# EAGLE board AZSMZ (EAGLE 6.1)
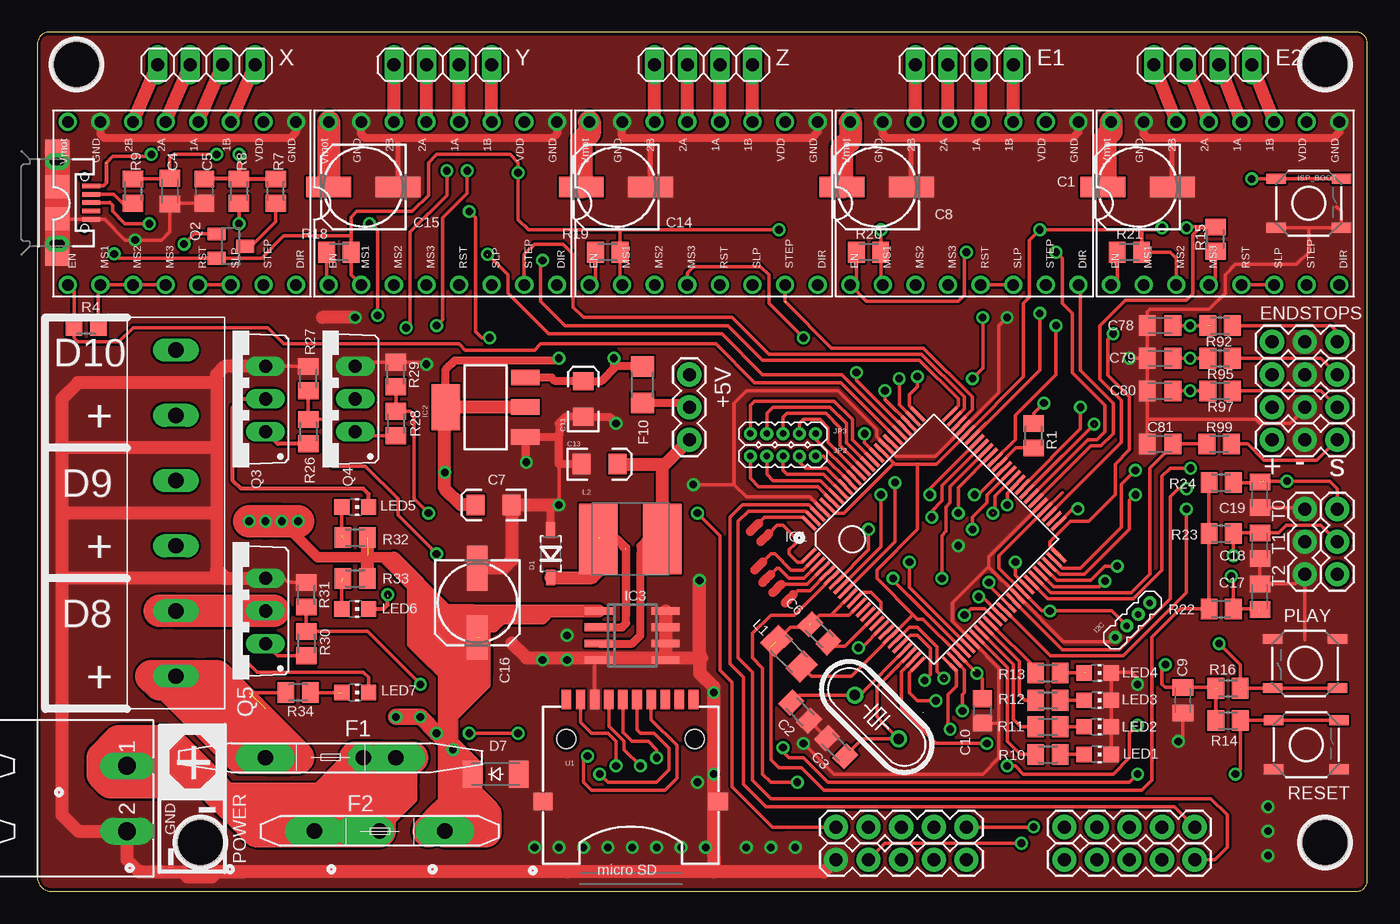
[diagram p2: board, top side]
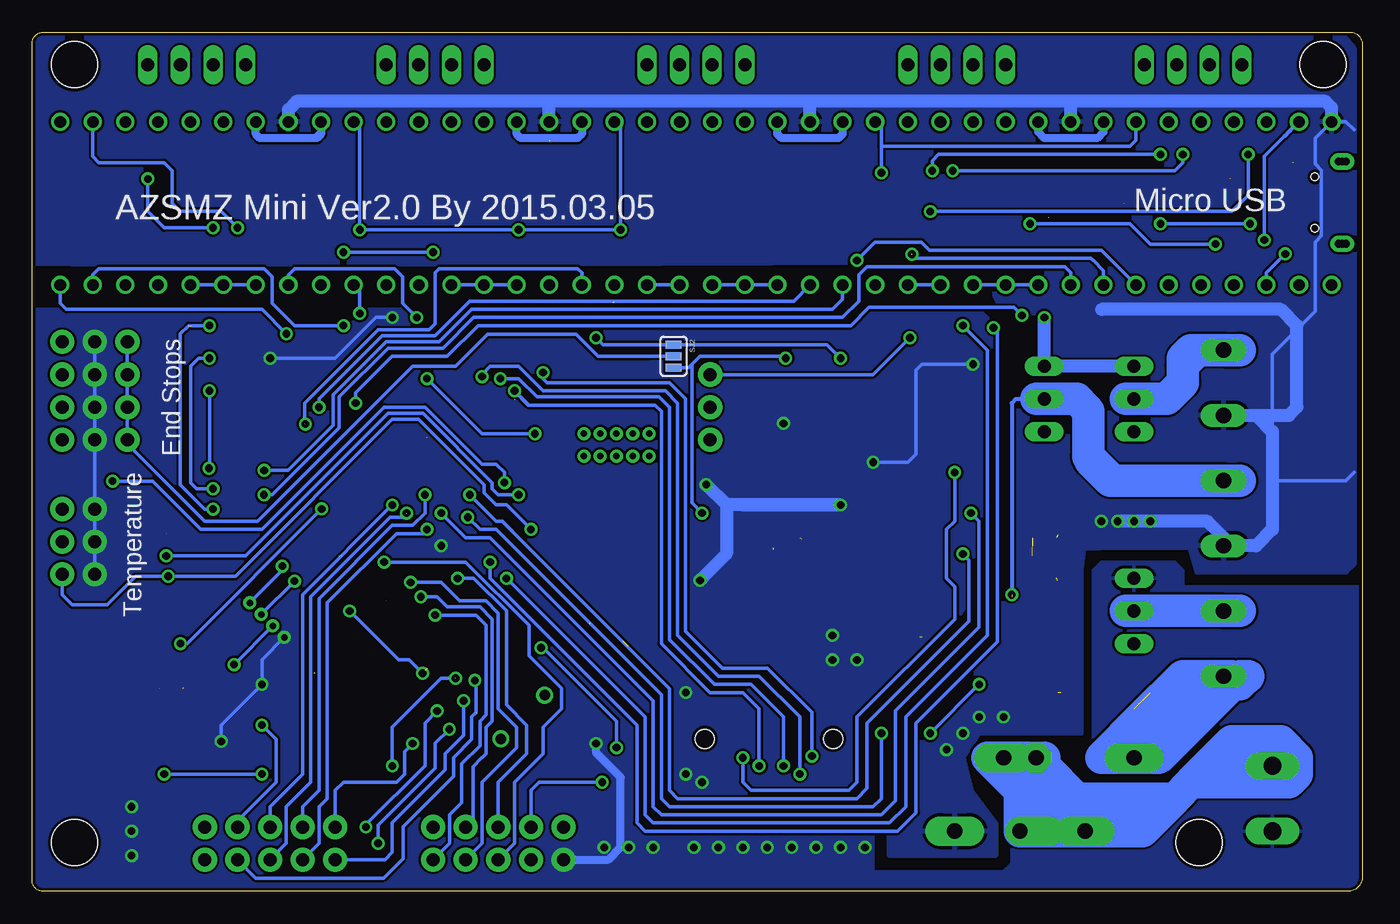
[diagram p3: board, bottom side, seen from below]

Size 103.64 x 66.93 mm. Coordinates in mm from the lower left corner, seen from the top.
Outline: 102.75,66.93 1.01,66.93 arc90 0.01,66.04 0.01,1.27 arc90 1.01,0 102.78,0 arc90 103.64,0.89 103.64,66.04 arc90 102.75,66.93
Copper layers (1*2+15*16): Top 0.035mm / dielectric 0.5mm / layer 2 0.035mm / dielectric 0.5mm / layer 15 0.035mm / dielectric 0.5mm / Bottom 0.035mm
Design rules: minimum track width 10mil, minimum drill 12mil, track to track 7mil, track to pad 7mil, pad to pad 7mil, via to via 7mil, smd to smd 7mil, copper to edge 10mil, drill to drill 8mil, minimum pad ring 10mil, minimum via ring 8mil, stop-mask expansion 0mil, vias tented up to drill 0.61mm, thermal gap 10mil
Holes 3.6 mm at 100.34,64.39 3.06,64.39 12.71,3.81 100.34,3.81

## Footprints (pad centres in the part's own frame; a part is rotated, then mirrored left to right if it is on the bottom)
HC49/S = drill 0.813: 1 -2.413,0; 2 2.413,0
1X03 = drill 1.016 pad 1.88: 1 0,0; 2 2.54,0; 3 5.08,0
153CLV-0605 = smd 3.5 x 1.6: + 2.7,0; - -2.7,0
C0805K = smd 1.3 x 1.6: 1 -1,0; 2 1,0
C0805 = smd 1.3 x 1.5: 1 -0.95,0; 2 0.95,0
EIA3216 = smd 1.4 x 1.6: A 1.4,0; C -1.4,0
SOD-123 = smd 1.2 x 0.7: A 1.85,0; C -1.85,0
SOD-123_MINI-SMA = smd 1.5 x 2.1: A 1.8,0; C -1.8,0
1X04 = drill 1.016 long: 1 -3.81,0; 2 -1.27,0; 3 1.27,0; 4 3.81,0
REPRAPJR_MFR1100 = drill 1.2 pad 2.3 long: 1 -5.08,0; 2 5.08,0 | drill 1.2 pad 2.3 octagon: 3 -2.54,0
REPRAPJR_MFR500 = drill 1.2 pad 2.3 long: 1 -5.08,0; 2 5.08,0 | drill 1.2 pad 2.3 offset: 3 0,0
R1206 = smd 1.6 x 1.803: 1 -1.422,0; 2 1.422,0
1X04-1.27MM = drill 0.508 pad 1: 1 0,0; 2 1.27,0; 3 2.54,0; 4 3.81,0
LQFP100 = smd 0.27 x 1.5: 1 -6,-7.75; 2 -5.5,-7.75; 3 -5,-7.75; 4 -4.5,-7.75; 5 -4,-7.75; 6 -3.5,-7.75; 7 -3,-7.75; 8 -2.5,-7.75; 9 -2,-7.75; 10 -1.5,-7.75; 11 -1,-7.75; 12 -0.5,-7.75; 13 0,-7.75; 14 0.5,-7.75; 15 1,-7.75; 16 1.5,-7.75; 17 2,-7.75; 18 2.5,-7.75; 19 3,-7.75; 20 3.5,-7.75; 21 4,-7.75; 22 4.5,-7.75; 23 5,-7.75; 24 5.5,-7.75; 25 6,-7.75; 51 6,7.75; 52 5.5,7.75; 53 5,7.75; 54 4.5,7.75; 55 4,7.75; 56 3.5,7.75; 57 3,7.75; 58 2.5,7.75; 59 2,7.75; 60 1.5,7.75; 61 1,7.75; 62 0.5,7.75; 63 0,7.75; 64 -0.5,7.75; 65 -1,7.75; 66 -1.5,7.75; 67 -2,7.75; 68 -2.5,7.75; 69 -3,7.75; 70 -3.5,7.75; 71 -4,7.75; 72 -4.5,7.75; 73 -5,7.75; 74 -5.5,7.75; 75 -6,7.75 | smd 1.5 x 0.27: 26 7.75,-6; 27 7.75,-5.5; 28 7.75,-5; 29 7.75,-4.5; 30 7.75,-4; 31 7.75,-3.5; 32 7.75,-3; 33 7.75,-2.5; 34 7.75,-2; 35 7.75,-1.5; 36 7.75,-1; 37 7.75,-0.5; 38 7.75,0; 39 7.75,0.5; 40 7.75,1; 41 7.75,1.5; 42 7.75,2; 43 7.75,2.5; 44 7.75,3; 45 7.75,3.5; 46 7.75,4; 47 7.75,4.5; 48 7.75,5; 49 7.75,5.5; 50 7.75,6; 76 -7.75,6; 77 -7.75,5.5; 78 -7.75,5; 79 -7.75,4.5; 80 -7.75,4; 81 -7.75,3.5; 82 -7.75,3; 83 -7.75,2.5; 84 -7.75,2; 85 -7.75,1.5; 86 -7.75,1; 87 -7.75,0.5; 88 -7.75,0; 89 -7.75,-0.5; 90 -7.75,-1; 91 -7.75,-1.5; 92 -7.75,-2; 93 -7.75,-2.5; 94 -7.75,-3; 95 -7.75,-3.5; 96 -7.75,-4; 97 -7.75,-4.5; 98 -7.75,-5; 99 -7.75,-5.5; 100 -7.75,-6
SOT223 = smd 1.219 x 2.235: 1 -2.311,-3.099; 2 0,-3.099; 3 2.311,-3.099 | smd 3.6 x 2.2: 4 0,3.099
SO08 = smd 0.6 x 2.2: 1 -1.905,-2.6; 2 -0.635,-2.6; 3 0.635,-2.6; 4 1.905,-2.6; 5 1.905,2.6; 6 0.635,2.6; 7 -0.635,2.6; 8 -1.905,2.6
TACTILE_SWITCH_SMD = smd 1.524 x 0.762: 1 -2.54,1.905; 2 2.54,1.905; 3 -2.54,-1.905; 4 2.54,-1.905
1X05-1.27MM = drill 0.508 pad 1: 1 0,0; 2 1.27,0; 3 2.54,0; 4 3.81,0; 5 5.08,0
1X05 = drill 1.016 pad 1.88: 1 0,0; 2 2.54,0; 3 5.08,0; 4 7.62,0; 5 10.16,0
M1206 = smd 1.6 x 2: 1 -1.4,0; 2 1.4,0
CR54 = smd 5.5 x 3: P$1 0,2.5; P$2 0,-2.5
CHIP-LED0805 = smd 1.2 x 1.2: A 0,-1.05; C 0,1.05
MSTBA2 = drill 1.397 long: 1 -2.54,5.08; 2 2.54,5.08
SOT23 = smd 1 x 1.4: 1 -0.95,-1.1; 2 0.95,-1.1; 3 0,1.1
TO220BV = drill 1.016 long: D 0,-2.54; G -2.54,-2.54; S 2.54,-2.54
M0805 = smd 1.3 x 1.6: 1 -0.95,0; 2 0.95,0
SJ_3 = smd 0.635 x 1.27: 1 -0.889,0; 2 0,0; 3 0.889,0
USD-SOCKET-PP = smd 0.75 x 1.5: 1 2.7,12.8; 2 1.6,12.8; 3 0.5,12.8; 4 -0.6,12.8; 5 -1.7,12.8; 6 -2.8,12.8; 8 -5,12.8; CD1 3.8,12.8; CD2 4.9,12.8 | smd 0.7 x 1.5: 7 -3.9,12.8 | smd 1.5 x 1.35: GND1 -6.83,4.84; GND2 6.83,4.84 | hole 1.5: -5,9.73; 5,9.73
282837-6 = drill 1.2 long: P$1 0,-12.7; P$2 0,-7.62; P$3 0,-2.54; P$4 0,2.54; P$5 0,7.62; P$6 0,12.7
A4988BREAKOUT = drill 0.9: 1A 8.89,1.27; 1B 11.43,1.27; 2A 6.35,1.27; 2B 3.81,1.27; DIR 16.51,-11.43; EN -1.27,-11.43; GND 16.51,1.27; GND@0 1.27,1.27; MS1 1.27,-11.43; MS2 3.81,-11.43; MS3 6.35,-11.43; RST 8.89,-11.43; SLP 11.43,-11.43; STEP 13.97,-11.43; VDD 13.97,1.27; VMOT -1.27,1.27
USB-MICROB = smd 0.35 x 1.4: D+ 0,2.65; D- -0.65,2.65; GND 1.3,2.65; ID 0.65,2.65; VBUS -1.3,2.65 | smd 1.8 x 1.9: MT1 -4,0; MT2 4,0; MT3 -1.25,0; MT4 1.25,0 | drill 0.6 pad 1.27: P$1 -3.2,-0.3; P$2 3.2,0; P$3 -3.2,0; P$4 -3.2,0.3; P$5 3.2,0.3; P$6 3.2,-0.3 | hole 0.6: 2,2.15; -2,2.15

## Placement (x,y rotation side)
12M  [HC49/S]  65.41,13.59 135 top
+5V  [1X03]  50.81,35.18 90 top
C1  [153CLV-0605]  85.73,54.86 180 top
C2  12pF  [C0805K]  59.44,14 315 top
C3  12pF  [C0805K]  62.24,11.24 135 top
C4  18pF  [C0805K]  10.33,54.55 90 top
C5  18pF  [C0805]  13.03,54.55 90 top
C6  100nF  [C0805K]  60.95,20.11 315 top
C7  10uF  [EIA3216]  35.57,30.1 180 top
C8  [153CLV-0605]  65.41,54.86 180 top
C9  100nF  [C0805K]  89.26,14.89 90 top
C10  100nF  [C0805]  73.64,14.07 90 top
C11  10uF  [EIA3216]  42.55,38.35 90 top
C13  10uF  [EIA3216]  43.82,33.27 0 top
C14  [153CLV-0605]  45.09,54.86 180 top
C15  [153CLV-0605]  25.41,54.86 180 top
C16  [153CLV-0605]  34.3,22.48 270 top
C17  .1uF  [C0805K]  95.26,22.96 270 top
C18  .1uF  [C0805K]  95.26,26.92 90 top
C19  .1uF  [C0805K]  95.26,30.89 90 top
C78  100nF  [C0805K]  87.48,44.07 180 top
C79  100nF  [C0805K]  87.48,41.53 180 top
C80  100nF  [C0805K]  87.48,38.99 180 top
C81  100nF  [C0805K]  87.48,34.86 180 top
D1  SS14  [SOD-123]  40.01,26.29 90 top
D7  IN4004  [SOD-123_MINI-SMA]  35.73,9.14 0 top
E1  [1X04]  72.24,64.39 0 top
E2  [1X04]  90.81,64.39 0 top
F1  [REPRAPJR_MFR1100]  22.87,10.41 180 top
F2  [REPRAPJR_MFR500]  26.68,4.7 0 top
F10  500MA  [R1206]  47.16,39.47 270 top
I2C  [1X04-1.27MM]  86.69,22.48 225 top
IC1  LPC1769  [LQFP100]  69.86,27.43 315 top
IC2  [SOT223]  34.93,37.72 90 top
IC3  LM2594  [SO08]  46.36,19.94 270 top
ISP_BOOT  [TACTILE_SWITCH_SMD]  99.07,53.59 0 top
JP2  [1X05-1.27MM]  60.65,33.91 180 top
JP3  [1X05-1.27MM]  55.57,35.66 0 top
JP8  [1X03]  101.29,42.8 180 top
JP9  [1X03]  101.29,40.26 180 top
JP10  [1X03]  101.29,37.72 180 top
JP11  [1X03]  101.29,35.18 180 top
JP12  [1X03]  101.29,24.7 90 top
JP14  [1X03]  98.75,24.7 90 top
JP15  [1X05]  72.4,5.02 180 top
JP16  [1X05]  90.18,2.48 180 top
JP17  [1X05]  90.18,5.02 180 top
JP32  [1X05]  72.4,2.48 180 top
L1  22uh  [M1206]  58.59,18.51 315 top
L2  68uH  [CR54]  46.21,27.46 90 top
LED1  [CHIP-LED0805]  82.62,10.67 270 top
LED2  [CHIP-LED0805]  82.62,12.83 270 top
LED3  [CHIP-LED0805]  82.62,14.89 270 top
LED4  [CHIP-LED0805]  82.62,17.02 270 top
LED5  [CHIP-LED0805]  24.77,29.94 270 top
LED6  [CHIP-LED0805]  24.77,22 270 top
LED7  [CHIP-LED0805]  24.77,15.49 270 top
PLAY  [TACTILE_SWITCH_SMD]  98.78,17.75 180 top
POWER  MSTBA2  [MSTBA2]  1.91,7.24 270 top
Q2  BSS84  [SOT23]  15.09,50.26 270 top
Q3  IRF512  [TO220BV]  15.25,38.35 90 top
Q4  IRF512  [TO220BV]  22.23,38.35 90 top
Q5  IRF512  [TO220BV]  15.25,21.84 90 top
R1  1.5K  [M0805]  77.64,35.5 270 top
R4  10K  [M0805]  3.82,44.07 0 top
R7  1.5K  [M0805]  18.58,54.55 270 top
R8  33R  [M0805]  15.72,54.55 90 top
R9  33R  [M0805]  7.47,54.55 90 top
R10  1k  [M0805]  78.75,10.67 180 top
R11  1k  [M0805]  78.75,12.83 180 top
R12  1k  [M0805]  78.75,14.89 180 top
R13  1k  [M0805]  78.75,17.02 180 top
R14  10K  [M0805]  92.78,13.3 180 top
R15  10K  [M0805]  91.8,50.81 270 top
R16  10K  [M0805]  92.77,15.82 180 top
R18  10K  [M0805]  23.5,49.78 0 top
R19  10K  [M0805]  44.46,49.78 0 top
R20  10K  [M0805]  64.78,49.78 0 top
R21  10K  [M0805]  85.1,49.78 0 top
R22  4k7  [M0805]  92.24,22 180 top
R23  4k7  [M0805]  92.24,27.88 180 top
R24  4k7  [M0805]  92.24,31.85 180 top
R26  10R  [M0805]  21.12,35.81 90 top
R27  100K  [M0805]  21.12,39.94 270 top
R28  10R  [M0805]  27.95,36.45 90 top
R29  100K  [M0805]  27.95,40.26 270 top
R30  10R  [M0805]  20.96,19.3 90 top
R31  100K  [M0805]  20.96,23.11 270 top
R32  1.8K  [M0805]  24.77,27.56 180 top
R33  1.8K  [M0805]  24.77,24.38 180 top
R34  1.8K  [M0805]  20.33,15.49 0 top
R92  1k  [M0805]  92.16,44.07 180 top
R95  1k  [M0805]  92.16,41.53 180 top
R97  1k  [M0805]  92.16,38.99 180 top
R99  1k  [M0805]  92.08,34.86 180 top
RESET  [TACTILE_SWITCH_SMD]  98.88,11.43 0 top
SJ2  [SJ_3]  53.67,41.69 270 bottom
U1  USD-SOCKETUSD  [USD-SOCKET-PP]  46.24,2.16 0 top
U$3  282837-6  [282837-6]  10.8,29.46 180 top
U$11  A4988BREAKOUT  [A4988BREAKOUT]  3.66,58.67 0 top
U$12  A4988BREAKOUT  [A4988BREAKOUT]  23.98,58.67 0 top
U$13  A4988BREAKOUT  [A4988BREAKOUT]  44.3,58.67 0 top
U$14  A4988BREAKOUT  [A4988BREAKOUT]  64.62,58.67 0 top
U$15  A4988BREAKOUT  [A4988BREAKOUT]  84.94,58.67 0 top
X  [1X04]  13.18,64.39 0 top
X1  USB-MICROB  [USB-MICROB]  1.56,53.64 270 top
Y  [1X04]  31.6,64.39 0 top
Z  [1X04]  51.92,64.39 0 top

## Tracks (layer width: path | path; a pad name or v marks a point on that pad's centre or on a via)
3.3V  (via drill 0.6)  (5 unrouted)
  Top 0.254: IC1.42 77.96,22.16 | IC1.96 62.17,29.46 62.87,29.46 66.68,33.27 66.68,33.44 | IC1.71 70.68,33.91 | IC1.84 66.68,33.44 | 66.68,33.44 66.84,33.27 68.59,33.27 | 68.59,33.27 70.04,33.27 IC1.71 | IC1.71 76.84,40.07 76.84,45.82 77.32,46.29 77.32,50.74 v78.11,51.53 86.05,51.53 | IC1.42 74.94,25.18 74.94,26.15 IC1.54 79.86,31.07 | 73.03,17.19 IC1.28 69.01,21.21 68.59,21.21 68.27,21.53 | 68.59,33.27 68.59,28.19 65.41,25.02 65.41,24.38 68.27,21.53 | 68.27,21.53 68.19,21.53 IC1.19 63.43,16.76 60.33,16.76 L1.2 | IC2.4 31.83,40.82 | 34.3,41.53 v40.65,41.53 | IC1.42 78.27,21.84 v78.91,21.84 83.73,21.84 I2C.3 | 45.41,51.53 38.27,51.53 37.47,52.32 v37.47,55.98 37.47,56.77 36.84,57.4 31.12,57.4 30.49,56.77 30.49,54.23 29.22,52.96 24.9,52.96 24.45,52.51 24.45,52.48 | 45.41,51.53 v57.79,51.53 | 86.05,51.53 87.48,51.53 v87.64,51.69 | U$11.MS3 U$11.MS2 U$11.MS1 4.77,47.08 R4.2 | R14.2 91.83,15.72 91.92,15.81 | U$15.MS2 88.75,49.31 88.27,49.78 R21.2 86.05,51.53 | U$13.MS3 50.65,48.2 51.12,48.67 56.36,48.67 57,48.04 57,45.82 v59.7,43.12 | 91.7,47.66 U$15.MS3 | C10.2 73.64,16.57 v73.21,16.99 72.85,17.35 | v87.91,17.67 87.64,17.4 87.64,16.13 87.88,15.89 C9.2 91.79,15.89 91.85,15.82 | U$12.MS1 24.45,48.04 R18.2 24.45,51.07 24.44,51.08 | 45.41,51.53 R19.2 45.41,47.41 U$13.MS1 | R20.2 v65.73,51.53 | v65.73,51.53 | R20.2 65.73,47.41 U$14.MS1 | R20.2 v65.73,51.52 v65.73,51.53 | R15.2 91.8,47.78 91.3,47.27 | 6.36,49.3 v6,49.66 6.35,49.31 Q2.2 17.47,49.31 19.22,51.05 24.42,51.05 24.44,51.08 | 24.44,51.08 24.44,52.5 | v48.27,10.41 48.27,11.05 47.63,11.68 46.36,11.68 45.64,12.41 U1.4
  Top 0.61: 31.83,32.64 IC2.4 31.83,40.65 32.55,41.37 40.49,41.37 v40.65,41.53
  Top 1.016: C7.A 33.03,30.1 31.76,31.37 v31.76,32.64 31.76,37.72 IC2.4 IC2.2
  Bottom 0.254: U$15.MS1 U$15.MS2 U$15.MS3 | U$14.MS3 U$14.MS2 U$14.MS1 | v40.65,41.53 41.7,42.58 SJ2.1 59.16,42.58 v59.7,43.12 | v31.76,32.64 31.76,28.83 32.39,28.19 32.39,24.38 31.76,23.75 31.76,21.21 39.38,13.59 39.38,8.51 40.01,7.87 47.63,7.87 48.27,8.51 v48.27,10.41 | I2C.3 v87.91,17.67 | 37.47,58.04 v37.47,55.98 | U$12.MS1 U$12.MS2 U$12.MS3 | 37.47,58.04 18.11,58.04 17.63,58.52 U$11.VDD | v78.91,21.84 75.1,18.03 74.25,18.03 v73.21,16.99 | U$15.VDD 98.91,57.25 98.43,56.77 93.35,56.77 92.72,56.13 92.72,53.59 92.08,52.96 88.91,52.96 v87.64,51.69 | 37.47,58.04 37.47,59.47 U$12.VDD | U$14.VDD 78.11,59.47 v78.11,51.53 v65.73,51.53 | U$13.VDD 57.79,59.47 v57.79,51.53 v65.73,51.53 | v65.73,51.53 66.05,51.53 | U$13.MS1 U$13.MS2 | U$13.MS2 48.27,47.24 | U$13.MS2 U$13.MS3 | U$11.MS2 7.47,48.19 v6,49.66
5V  (via drill 0.6)
  Top 0.254: 42.55,39.62 40.65,39.62 40.24,40.03 IC2.3 | 47,40.89 44.93,40.89 v44.93,41.53 | v51.44,29.46 53.19,27.72 53.19,17.24 54.14,16.29 54.14,8.17 57.3,5.02 | 57.3,5.02 57.31,5 58.22,5 | JP15.5 57.3,5.02
  Top 0.406: C11.A 42.55,39.62
  Top 0.61: IC2.3 40.08,40.03 40.36,39.75 C11.A 43.95,39.75 45.09,40.89 | F10.1 45.09,40.89 | v44.93,41.53 44.93,41.04 45.09,40.89
  Bottom 0.254: SJ2.3 52.49,40.8 52.24,41.05 | v44.93,41.53 45.09,41.69 51.6,41.69 52.24,41.05 | 52.24,41.05 52.24,30.26 v51.44,29.46
A_STOP
  Top 0.254: R99.2 C81.1 | IC1.45 78.97,23.27 85.26,23.27 86.68,24.7 86.68,32.96 88.48,34.75 C81.1 | C81.1 88.48,35.39
AGND
  Top 0.254: IC1.11 64.32,23.3 64.97,23.3 65.73,22.54 65.73,21.89 IC1.15 62.92,19.08 61.97,19.08 C6.2
AVCC  (2 unrouted)
  Top 0.254: 60.26,20.79 C6.1 60.95,21.53 61.83,21.53 | R24.2 R23.2 R22.2 89.07,22 86.84,19.78 86.84,8.67 86.05,7.87 61.29,7.87 59.54,9.62 57.79,9.62 57.16,10.25 57.16,19.07 | IC1.12 63.24,21.53 61.83,21.53 | IC1.10 61.83,21.53 | L1.1 58.67,20.57 60.33,20.57 60.17,20.73 60.17,20.89
DIR1  (via drill 0.6)  (1 unrouted)
  Top 0.254: IC1.80 62.69,40.26 56.52,40.26 53.35,43.43 39.85,43.43 36.68,46.61 36.68,48.04 v35.09,49.62 36.2,48.51
  Bottom 0.254: U$11.DIR 20.17,48.36 20.96,49.15 20.99,49.15 21.14,49.3 34.75,49.3 35.06,49.61
DIR2  (via drill 0.6)
  Top 0.254: IC1.49 79.89,25.18 81.29,25.18 84.46,28.35 84.46,31.7 v85.55,32.79
  Bottom 0.254: U$12.DIR 40.49,46.13 41.28,45.34 69.38,45.34 71.92,42.8 76.05,42.8 80.18,38.67 80.18,36.29 83.68,32.79 v85.55,32.79
DIR3  (via drill 0.6)  (2 unrouted)
  Top 0.254: 77.5,31.55 v82.35,36.4 | IC1.58 82.4,36.44
  Bottom 0.254: U$13.DIR 60.81,48.2 61.13,48.51 71.92,48.51 72.24,48.2 72.24,44.23 72.71,43.75 76.68,43.75 82.4,38.04 82.4,36.44 v82.35,36.4
DIR4
  Top 0.254: IC1.56 | IC1.56 78.59,31.21 | IC1.56 82.08,34.7 82.88,34.7 83.83,35.66 83.83,38.04 81.29,40.58 81.29,47.09 U$14.DIR
DIR5  (via drill 0.6)  (1 unrouted)
  Top 0.254: 79.7,26.13 78.91,26.92 78.91,27.24 80.49,28.83 81.92,28.83 83.99,30.89 83.99,33.27 85.1,34.39 85.1,38.51 83.42,40.19 83.42,43.02 v83.83,43.43
  Bottom 0.254: v83.83,43.43 85.73,45.34 100.97,45.34 101.45,45.82 U$15.DIR
EN1
  Top 0.254: IC1.81 62.62,39.62 55.89,39.62 52.87,42.64 39.22,42.64 38.74,42.16 33.34,42.16 32.87,42.64 19.22,42.64 17.95,43.91 7.47,43.91 6.36,42.8 3.18,42.8 2.97,43.01 2.87,43.11 R4.1 2.87,46.77 U$11.EN
EN2  (via drill 0.6)  (1 unrouted)
  Top 0.254: IC1.48 79.66,24.7 81.6,24.7 85.1,28.19 85.1,30.45 85.55,30.91 | 22.65,47.3 U$12.EN 22.55,47.4 R18.1
  Bottom 0.254: U$12.EN 22.71,48.2 23.18,48.67 38.58,48.67 39.22,48.04 39.22,45.97 40.49,44.7 69.22,44.7 71.6,42.32 75.89,42.32 79.7,38.51 79.7,36.13 84.94,30.89 v85.57,30.89
EN3  (via drill 0.6)
  Top 0.254: v81.29,37.72 81.29,36.03 IC1.59 | R19.1 43.51,47.72 U$13.EN
  Bottom 0.254: v81.29,37.72 81.29,38.35 76.37,43.28 72.24,43.28 69.54,45.97 44.3,45.97 U$13.EN
EN4  (via drill 0.6)
  Top 0.254: IC1.57 81.85,35.18 82.56,35.18 83.19,35.81 83.19,37.88 80.65,40.42 80.65,45.02 79.86,45.82 79.86,49.31 v79.38,49.78 | v72.4,49.78 72.24,49.62 72.24,46.45 71.76,45.97 64.62,45.97 U$14.EN 63.83,47.72 R20.1
  Bottom 0.254: v72.4,49.78 v79.38,49.78
EN5  (via drill 0.6)
  Top 0.254: v73.67,44.7 73.67,40.73 v72.87,39.94 | IC1.85 64.46,34.95 v64.46,35.66 | R21.1 84.15,47.72 U$15.EN
  Bottom 0.254: v64.46,35.66 68.59,35.66 v72.87,39.94 | v73.67,44.7 74.78,45.82 74.78,47.88 75.41,48.51 83.19,48.51 83.67,48.04 U$15.EN
ENET_CRS
  Top 0.254: 59.38,33.75 JP2.2 59.38,33.43 59.86,32.96 61.5,32.96 IC1.92
ENET_MDC
  Top 0.254: IC1.87 63.03,34.97 63.03,36.45 61.76,37.72 57.32,37.72 56.84,37.24 JP3.2
ENET_MDIO
  Top 0.254: IC1.86 63.51,35.2 63.51,36.77 62.08,38.2 55.89,38.2 55.57,37.88 JP3.1
ENET_REF_CLK
  Top 0.254: IC1.88 62.55,34.73 62.55,36.13 61.44,37.24 58.43,37.24 58.11,36.93 JP3.3
ENET_RX_ER
  Top 0.254: IC1.89 61.6,34.98 61.6,36.13 60.97,36.77 59.7,36.77 59.38,36.45 JP3.4
ENET_RXD0
  Top 0.254: IC1.91 61.26,33.91 JP2.1
ENET_RXD1
  Top 0.254: IC1.90 60.65,35.23 JP3.5
ENET_TX_EN
  Top 0.254: IC1.93 61.27,32.48 58.43,32.48 58.11,32.8 JP2.3
ENET_TXD0
  Top 0.254: 55.57,32.8 JP2.5 55.57,32.16 56.2,31.53 60.81,31.53 IC1.95
ENET_TXD1
  Top 0.254: 56.84,32.64 JP2.4 56.84,32.48 57.32,32 61.04,32 IC1.94
GND  (via drill 0.6)
  Top 0.254: IC1.55 74.14,26.06 74.14,25.34 | IC1.97 61.2,29.74 | 13.98,29.46 13.98,25.65 15.25,24.38 Q5.S 19.22,24.38 19.54,24.06 R31.1 | 24.99,41.11 Q4.S 25.09,41.21 R29.1 30.17,41.21 v30.33,41.05 30.27,41.11 | C18.1 C17.1 98,23.95 JP14.1 98.75,19.62 | LED1.C LED2.C LED3.C LED4.C 83.67,15.02 83.83,14.86 | IC1.97 60.34,30.58 60.33,30.57 | v85.1,41.53 86.37,41.53 | v85.73,16.13 85.73,16.61 85.26,17.08 83.67,17.08 | IC1.72 74.46,38.4 | IC1.72 69.97,33.91 66.92,33.91 IC1.83 65.41,35.41 65.41,35.97 62.4,38.99 55.25,38.99 54.3,38.04 54.3,31.69 | 17.84,40.95 Q3.S R27.1 | 52.9,2.98 52.71,2.79 | 40.65,33.27 v40.65,30.1 | IC1.72 74.62,38.56 | IC1.72 74.94,38.88 74.94,44.07 v75.57,44.7 | 74.14,25.34 71.29,22.48 71.29,21.05 IC1.31 74.94,17.4 74.94,13.11 | 74.14,25.34 74.14,25.27 IC1.41 79.95,19.46 83.67,19.46 I2C.4 | IC3.4 42.23,18.03 | IC1.97 60.19,30.73 55.25,30.73 54.3,31.69 | 74.94,13.11 74.94,10.41 73.67,9.14 62.08,9.14 v59.7,11.52 | v38.11,33.43 38.11,35.33 IC2.1 | 97.53,29.89 C19.1 98.64,29.89 JP14.3 | 98.75,37.56 97.64,36.45 95.26,36.45 94.94,36.77 86.53,36.77 86.48,36.72 C81.2 C80.2 C79.2 C78.2 86.48,45.13 86.68,45.34 91.29,45.34 92.56,46.61 92.56,48.04 93.35,48.83 98.12,48.83 99.07,49.78 99.07,51.69 | v51.12,31.69 54.3,31.69 | 41.92,18.03 41.76,18.19 41.76,18.35 | C5.1 10.17,53.6 10.17,53.59 | 10.33,52.48 C4.1 10.33,51.37 9.69,50.74 v7.63,50.74 6.85,50.74 5.24,52.35 X1.GND 1.28,52.35 | C10.1 74.93,13.12 74.94,13.11 | C9.1 89.26,12.03 v88.91,11.68 | C2.2 61.13,12.32 61.6,12.32 | 101.22,53.35 101.61,52.96 ISP_BOOT.4 99.07,51.69 | 1.3,52.35 1.28,52.32 | X1.P$6 1.89,50.45 1.91,50.42 | U1.6 43.44,18.26
  Top 0.254: ISP_BOOT.3 99.07,51.69
  Top 0.406: 5.09,58.67 9.53,58.67 | 9.53,58.67 19.06,58.67 | 25.41,58.67 25.57,58.67 | 36.84,58.67 39.38,58.67 | 45.73,58.67 47.63,58.67 | 47.63,58.67 60.33,58.67 | 80.65,58.67 68.11,58.67 C8.- 68.11,55.97 | 100.5,58.67 88.27,58.67 88.43,58.51 C1.- | C15.- 28.11,58.67 | C14.- 47.79,58.51 47.63,58.67 | 9.51,58.65 9.53,58.67
  Top 0.61: U$15.GND 101.45,59.15 100.97,58.67 86.53,58.67 86.21,58.99 U$15.GND@0 | U$14.GND 81.13,59.15 80.65,58.67 66.21,58.67 65.89,58.99 U$14.GND@0 | U$13.GND 60.81,59.15 60.33,58.67 45.73,58.67 45.57,58.83 U$13.GND@0 | U$12.GND 40.49,58.99 40.17,58.67 36.84,58.67 25.57,58.67 25.25,58.99 U$12.GND@0 | U$11.GND 20.17,59.15 19.69,58.67 5.25,58.67 4.93,58.99 U$11.GND@0 | 40.65,35.5 40.65,33.27 C13.C | v45.09,36.45 44.59,36.95 C11.C 41.15,36.95 40.65,36.45 40.65,35.5 | 40.65,35.5 40.56,35.41 IC2.1 38.03,33.51 v38.11,33.43 | D1.A 40.01,30.1
  Top 0.813: 8.26,1.52 10.8,1.52
  Top 1.016: 52.71,15.85 v52.71,15.49 v52.71,9.14 52.71,2.79 52.71,1.52 | 52.71,1.52 61.3,1.52 62.24,2.46 | 52.71,1.52 41.28,1.52 | 41.28,1.52 13.98,1.52 | 41.23,1.58 41.28,1.52 | Q3.S 14.61,40.89 13.98,40.26 13.98,39.62 | 13.98,39.62 13.98,34.54 | 13.98,34.54 13.98,29.46 | 13.98,29.46 13.98,25.02 14.61,24.38 | 14.61,24.38 Q5.S | 36.84,30.1 C7.C | C7.C 40.01,30.1 v40.65,30.1 | 48.9,18.19 41.76,18.19 38.11,18.19 36.97,19.33 | 48.9,18.19 49.06,18.19 | 49.06,18.19 51.6,18.19 | 51.6,18.19 51.76,18.19 | 48.96,18.25 48.9,18.19 | 48.96,21.78 IC3.7 IC3.6 48.96,18.29 49.06,18.19 | IC3.8 48.96,20.63 48.9,20.57 | 51.6,18.19 v51.6,24.22 | C7.C 36.97,25.78 36.36,25.18 34.77,25.18 | 13.98,39.62 3.18,39.62 1.91,38.35 1.91,34.54 | 1.91,34.54 1.91,29.46 | 1.91,29.46 1.91,24.38 | 1.91,24.38 1.91,5.97 3.18,4.7 POWER.2 6.99,2.48 7.95,1.52 8.26,1.52 11.31,1.52 11.69,1.14 13.62,1.14 14.03,1.55 16.01,1.55 16.06,1.5 | 13.98,34.54 1.91,34.54 | 13.98,29.46 1.91,29.46 | 14.61,24.38 1.91,24.38 | v24.77,44.7 22.23,44.7 | 51.57,18.57 51.62,18.52 51.62,17.04 52.71,15.95 52.71,15.85 | 51.6,18.19 51.6,16.96 52.71,15.85
  Top 1.93: X1.MT1 X1.P$2 1.53,50.42
  Bottom 0.254: JP8.2 JP9.2 JP10.2 JP11.2 JP14.3 JP14.2 JP14.1 | v85.1,41.53 80.02,41.53 76.84,44.7 v75.57,44.7 | 49.54,30.1 48.27,30.1 | 40.81,30.1 v40.65,30.1 | I2C.4 85.73,18.04 v85.73,16.13 88.91,12.95 v88.91,11.68 | v30.33,41.05 34.3,41.05 34.77,40.58 34.77,34.07 35.41,33.43 v38.11,33.43 | v7.63,50.74 7.63,57.25 5.64,59.23
  Bottom 0.305: 6.04,58.83 5.64,59.23 U$11.GND@0 | U$14.GND 81.13,59.31 81.76,58.67 85.89,58.67
  Bottom 0.406: 20.64,58.67 24.14,58.67
  Bottom 0.61: U$14.GND 81.13,58.99 81.45,58.67 85.89,58.67 86.21,58.99 U$15.GND@0 | U$13.GND 60.81,58.99 61.13,58.67 65.57,58.67 65.89,58.99 U$14.GND@0 | U$12.GND 40.49,58.99 40.81,58.67 45.25,58.67 45.57,58.99 U$13.GND@0 | U$11.GND 20.17,59.15 20.64,58.67 24.77,58.67 25.25,59.15 U$12.GND@0 | JP32.5 58.74,2.48 57.79,3.43 57.79,8.89 59.7,10.79 59.7,11.51
  Bottom 1.016: 48.27,30.1 40.81,30.1 | v40.65,30.1 49.54,30.1 | v51.12,31.69 49.54,30.1 | 49.54,30.1 49.54,26.29 51.44,24.38 | Q3.S Q4.S v24.77,44.7
  other vias: 71.76,26.92 95.89,6.6 95.89,4.7 95.89,2.79 51.44,8.51 41.28,19.94 39.38,18.03 41.28,18.03 38.74,3.43 40.65,3.43 42.55,3.43 44.46,3.43 46.36,3.43 48.27,3.43 50.17,3.43 52.08,3.43 55.25,3.43 57.16,3.43 59.06,3.43
  pour Top (no thermals): -1.26,-0.38 0.64,-2.29 102.88,-2.29 106.69,1.52 106.69,66.93 106.05,67.56 0.64,67.56 0.01,68.2
  pour Bottom (no thermals): 37.47,-2.29 38.11,0.89 38.11,14.22 32.39,19.94 29.85,23.75 28.91,28.14 28.91,44.4 29.85,45.34 104.78,45.34 105.42,44.7 105.42,0.25 103.51,-1.65 39.38,-1.65 38.74,-2.29
  pour Bottom: -0.63,23.75 6.99,23.75 13.98,23.75 13.98,25.02 14.61,25.65 20.33,25.65 20.96,25.02 20.96,11.68 21.6,11.05 29.22,11.05 29.85,10.41 29.85,8.51 29.22,7.87 27.95,6.6 27.31,5.97 27.31,2.16 27.95,1.52 38.74,1.52 38.74,-1.02 -0.63,-1.02 -1.26,-0.38
ISP_BOOT  (via drill 0.6)
  Top 0.254: IC1.53 84.46,34.97 84.46,38.25 82.81,39.9 82.81,44.07 84.79,46.05 89.52,46.05 90.03,46.56 90.03,51.13 90.58,51.69 91.87,51.69 R15.1 89.61,51.76 v89.54,51.69 | ISP_BOOT.2 ISP_BOOT.1 v94.62,55.5
  Bottom 0.254: v94.62,55.5 94.62,52.96 93.35,51.69 v89.54,51.69
ISPBOOT  (via drill 0.6)
  Top 0.254: IC1.17 64.24,18.99 v63.98,18.99 | v85.73,9.14 85.1,8.51 61.6,8.51 59.7,10.41 58.59,10.41 58.11,10.89 v58.11,11.21 | R14.1 93.73,13.27 93.67,13.33 | R14.1 93.73,9.52 v93.35,9.14 | RESET.2 RESET.1 93.76,13.33 R14.1
  Bottom 0.254: v63.98,18.99 63.83,18.99 58.11,13.27 v58.11,11.21 | v85.73,9.14 v93.35,9.14
JTAG-RTCK
  Top 0.254: 60.13,28.63 IC1.100 59.66,29.15 56.68,29.15 56.2,28.67
  Top 0.711: 55.57,28.04 56.2,28.67
JTAG-TCK
  Top 0.254: IC1.5 60.2,23.43 59.22,23.43 58.51,22.72
  Top 0.711: 58.27,22.48 58.51,22.72 58.9,23.11
JTAG-TDI
  Top 0.254: IC1.2 59.67,25.02 58.74,25.02 57.48,26.29 57.16,26.29 56.05,25.18
  Top 0.711: 56.52,25.65 56.05,25.18 55.89,25.02
JTAG-TDO
  Top 0.254: 57,27.88 57.63,28.51 58.11,28.51 59.06,27.56 59.06,27.08 58.59,26.61 58.59,26.29 59.22,25.65 59.59,25.65 IC1.1
  Top 0.711: 56.36,27.24 57,27.88
JTAG-TMS
  Top 0.254: IC1.3 59.74,24.38 58.59,24.38 57.79,25.18 57.63,25.18 56.76,24.3
  Top 0.711: 56.52,24.07 56.76,24.3 57.16,24.7
JTAG-TRST
  Top 0.254: IC1.4 59.97,23.91 57.95,23.91
  Top 0.711: 57.95,23.91 57.32,23.27
LED1
  Top 0.254: IC1.32 75.57,17.47 75.57,11.68 76.59,10.67 R10.2
LED2
  Top 0.254: IC1.33 76.05,17.7 76.05,13.43 76.65,12.83 R11.2
LED3
  Top 0.254: IC1.34 76.52,17.94 76.52,17.24 76.52,15.33 76.97,14.89 R12.2
LED4
  Top 0.254: IC1.35 77.8,17.37 R13.2
MISO1  (via drill 0.6)  (1 unrouted)
  Top 0.254: IC1.61 74.62,30.78 74.62,29.62 v74.46,29.46
  Bottom 0.254: v74.46,29.46 74.62,29.3 | 74.48,29.44 74.79,29.13 75.74,29.13 81.92,22.95 81.92,8.51 83.83,6.6 83.83,3.75 JP16.3
MOSI1  (via drill 0.6)
  Top 0.254: IC1.60 75.57,31.03 v75.57,30.1
  Bottom 0.254: v75.57,30.1 82.56,23.11 82.56,9.14 85.1,6.6 JP17.3
N$1
  Top 0.254: 66.57,17.78 IC1.22 64.08,15.29 12M.2 59.4,15.29 58.82,14.71 C2.1
N$2
  Top 0.254: 66.81,17.31 67.42,17.93 | 67.42,17.93 IC1.23 65.41,15.92 65.41,13.59 66.05,12.95 | 66.48,16.99 67.42,17.93 | 66.05,12.95 67,12 66.88,11.88 64.29,11.88 C3.1 | 64.52,11.88 12M.1 66.05,12.95 | 66.05,12.95
N$3
  Top 1.016: U$11.2B X.1
N$4
  Bottom 0.254: U$12.RST U$12.SLP
N$5  (via drill 0.6)
  Top 0.254: R1.1 77.64,37.24 v78.43,38.04 | Q2.1 12.23,51.21 v11.44,50.42 | 26.52,50.9 v26.52,44.86 26.52,51.53 26.04,52.01 v25.88,52.01
  Bottom 0.254: v78.43,38.04 78.43,38.83 75.57,41.69 71.29,41.69 68.9,44.07 39.85,44.07 38.42,45.5 27.15,45.5 v26.52,44.86 | v11.44,50.42 16.52,50.42 18.11,52.01 v25.88,52.01
N$6
  Top 1.016: U$11.2A X.2
N$7
  Top 1.016: U$11.1A X.3
N$8
  Top 1.016: U$12.2B Y.1
N$9
  Top 0.254: U$11.RST U$11.SLP
N$10
  Top 1.016: U$12.2A Y.2
N$11
  Top 1.016: U$12.1A Y.3
N$12
  Top 1.016: U$12.1B Y.4
N$13
  Top 1.016: U$11.1B X.4
N$14
  Bottom 0.254: U$13.RST U$13.SLP
N$15
  Top 1.016: U$13.2B Z.1
N$17
  Top 1.016: U$13.2A Z.2
N$18  (1 unrouted)
  Top 0.254: R34.2 23.5,15.49
N$19
  Top 0.813: 29.22,9.78 29.22,10.41 27.95,9.14 | 29.22,9.14 29.22,8.51 | 29.22,7.87 29.22,7.24 F2.3 26.68,5.33 29.22,7.87 | 29.22,7.87 29.22,8.51 | 29.22,8.51 27.31,6.6 27.31,7.87 | 27.31,7.87 27.95,7.87 29.22,9.14 | 29.22,9.14 29.22,9.78 | 27.31,7.87 29.22,9.78
  Top 1.016: 26.68,10.41 F1.1
  Top 2.54: 5.09,9.78 POWER.1 12.07,9.78 | 15.88,5.97 17.15,4.7 F2.1 | F2.1 F2.3 26.68,10.41 | 26.68,10.41 F1.3 | F1.3 24.77,10.41 | 26.68,10.41 29.22,10.41 | F1.3 25.41,6.6 24.77,5.97 15.88,5.97 | 12.07,9.78 13.34,8.51 | 14.61,7.24 15.88,5.97 | F2.1 21.6,6.6 F1.3 | 12.07,9.78 10.17,11.68 6.36,11.68 5.09,10.41 5.09,9.14 5.72,8.51 13.34,8.51 | 13.34,8.51 14.61,7.24 | 14.61,7.24 23.5,7.24 24.14,7.87
  Bottom 2.54: POWER.1 12.07,9.78 | 12.07,9.78 13.34,8.51 | 14.61,7.24 17.15,4.7 F2.1 | F2.1 F2.3 | F2.3 26.68,5.97 | 22.23,7.24 24.77,9.78 24.77,10.41 29.22,10.41 26.68,7.87 | 21.6,6.6 22.23,7.24 | 22.23,7.24 14.61,7.24 | 12.07,9.78 10.17,11.68 6.36,11.68 5.09,10.41 5.09,9.14 5.72,8.51 13.34,8.51 | 13.34,8.51 14.61,7.24 | F2.1 21.6,5.33 26.04,9.78 26.04,7.24 | 26.04,7.24 24.14,5.33 24.77,5.33 | 26.68,7.87 26.04,7.24 | 26.04,7.24 26.04,5.33 F2.3 | F2.3 26.68,7.87
N$20
  Top 1.016: U$13.1A Z.3
N$21
  Top 1.016: U$13.1B Z.4
N$22
  Top 0.254: U$14.RST U$14.SLP
N$24
  Top 1.016: U$14.2B E1.1
N$25
  Top 1.016: U$14.2A E1.2
N$26
  Top 1.016: U$14.1A E1.3
N$27
  Top 1.016: U$14.1B E1.4
N$28
  Top 0.254: U$15.RST U$15.SLP
N$29
  Top 1.016: U$15.2B E2.1
N$30
  Top 1.016: U$15.2A E2.2
N$31
  Top 1.016: U$15.1A E2.3
N$32
  Top 1.016: U$15.1B E2.4
N$35
  Top 0.254: 18.48,35.12 Q3.G
  Top 0.305: R26.1 18.74,34.86 Q3.G
N$36
  Top 0.254: 24.99,35.6 Q4.G 25.09,35.5 R28.1
N$37
  Top 0.254: 18,19.09 Q5.G 18.74,18.35 R30.1
N$40
  Top 0.61: F10.2 50.48,38.04 +5V.2
N$41  (2 unrouted)
  Top 0.254: IC3.2 45.73,20.57 45.73,26.29
  Top 0.61: IC3.2 45.57,20.57 45.89,20.89 45.89,26.61 45.57,26.92 | L2.P$1 45.19,27.46 45.88,26.77 45.88,21.51
  Top 1.016: D1.C 43.24,24.44 43.82,25.02 43.82,27.56
N$43
  Top 0.254: 47.63,33.27 48.9,33.27
  Top 0.61: IC3.3 46.36,19.3 47,19.94 47,26.29 | 47,26.29 47.63,26.92 49.54,26.92 | 49.74,34.11 +5V.1 | C13.A 47.63,33.27 | L2.P$2 47.53,27.46 47,26.92 47,26.29
  Top 1.016: L2.P$2 48.71,33.08 48.9,33.27 | 48.9,33.27 +5V.1 | C13.A 48.9,33.27
N$44
  Top 0.305: LED5.C 25.82,30.95 25.41,31.37 15.88,31.37 15.25,32 15.25,37.72 15.88,38.35 Q3.D
  Bottom 1.016: 13.98,39.62 13.98,38.99 14.61,38.35 15.25,38.35
  Bottom 2.54: 18.42,38.35 Q3.D 15.25,38.35 13.98,39.62 13.98,40.89 | 13.98,40.89 13.98,41.02 13.16,41.83 | 9.53,42.16 U$3.P$1 13.34,42.16 13.98,41.53 13.98,40.89
N$45  (via drill 0.6)  (1 unrouted)
  Top 0.305: LED6.C 27,22 27.31,22.32 27.31,22.95
  Bottom 0.254: 21.6,37.72 20.96,37.08 20.96,32.64 20.33,32 | 26.04,38.35 26.68,38.35 | 27.31,37.72 v27.31,23.11
  Bottom 0.305: 25.41,38.35 26.04,38.35 27,38.35 27.31,38.04 v27.31,23.11
  Bottom 1.016: U$3.P$3 20.01,32 20.96,32.96 20.96,37.4 21.91,38.35 22.23,38.35
  Bottom 2.54: 25.41,38.35 Q4.D 22.23,38.35 21.6,37.72 21.6,37.67 21.34,37.41 21.34,33.86 19.57,32.08 | 9.53,32 U$3.P$3 19.64,32 21.19,33.55
N$46
  Top 0.254: 16.52,21.84 Q5.D 17.15,21.84 15.72,20.41 15.72,18.51 17.15,17.08 25.41,17.08 25.82,16.67 LED7.C
  Top 1.016: U$3.P$5 Q5.D
  Top 2.54: 18.42,21.84 U$3.P$5 9.53,21.84
  Bottom 2.54: 18.42,21.84 U$3.P$5 9.53,21.84
N$48  (1 unrouted)
  Top 0.254: LED6.A 23.72,24.18
N$49  (1 unrouted)
  Top 0.254: LED5.A 23.72,27.76
N$51  (1 unrouted)
  Top 0.254: Q2.3 16.68,50.26 18.58,52.17 R7.2
N$61  (via drill 0.6)
  Top 0.254: R8.1 v15.72,52.01 | v8.74,52.01 6.83,52.01 5.88,52.96 5.88,53.44 5.66,53.66 5.64,53.65 X1.D+
  Bottom 0.254: v8.74,52.01 v15.72,52.01
N$62
  Top 0.254: 5.96,54.31 5.97,54.3 | R9.1 6.67,53.6 6.33,53.94 5.97,54.3 | X1.D- 5.97,54.3
N$84  (1 unrouted)
  Top 0.254: R13.1 81.67,17.02 81.92,16.76
N$85
  Top 0.254: R12.1 LED3.A
N$86
  Top 0.254: R11.1 LED2.A
N$87
  Top 0.254: R10.1 LED1.A
N$114
  Top 0.254: R95.1 100.02,41.53 JP9.1
N$115
  Bottom 0.254: JP8.3 JP9.3 JP10.3 JP11.3 96.21,34.86 90.18,28.83 86.05,28.83 73.99,40.89 70.65,40.89 68.14,43.41 61.27,43.41 59.55,41.69 | 59.55,41.69 59.55,41.68 55.63,41.68 | SJ2.2 59.55,41.69
N$116
  Top 0.254: R97.1 100.02,38.99 JP10.1
N$117
  Top 0.254: R99.1 94.3,34.86 95.57,33.59 99.7,33.59 JP11.1
N$122
  Top 0.254: 99.07,44.07 R92.1 100.81,44.07 101.29,43.59 JP8.1
P0_26  (via drill 0.6)
  Top 0.254: IC1.6 59,21.53 57.16,21.53 55.73,20.1 55.73,18.19 56.52,17.4 56.52,9.14 57.16,8.51 v59.22,8.51
  Bottom 0.254: 61.13,8.51 v59.22,8.51 64.14,8.51 64.78,7.87 JP15.4
P1_22  (via drill 0.6)  (1 unrouted)
  Top 0.254: IC1.36 73.85,22.02 72.75,22.02 72.25,21.51
  Bottom 0.254: v72.24,21.53 69.06,21.53 68.27,20.73 68.27,13.75 68.75,13.27 68.75,11.37 70.18,9.94 70.18,6.92 71.13,5.97 71.13,3.75 JP32.1
P1_23  (via drill 0.6)
  Top 0.254: IC1.37 73.63,22.95 v73.35,22.95
  Bottom 0.254: v73.35,22.95 72.08,22.95 71.29,22.16 68.75,22.16 67.79,21.21 67.79,13.27 68.27,12.79 68.27,10.73 68.59,10.41 68.61,10.41 69.3,9.73 69.3,5.58 JP15.2
P1_25  (via drill 0.6)
  Top 0.254: 74.25,23.75 IC1.39 74.14,23.85 v74.14,24.07
  Bottom 0.254: v74.14,24.07 71.76,24.07 70.33,22.64 68.27,22.64 67.32,21.68 67.32,14.22 65.89,12.79 65.89,11.21 68.59,8.51 68.59,3.75 JP32.2
P1_27  (via drill 0.6)
  Top 0.254: IC1.43 76.21,24.62 v76.21,25.65
  Bottom 0.254: v76.21,25.65 69.86,25.65 64.94,20.73 64.94,18.35 62.4,15.81 62.4,14.22 63.81,12.81 63.81,10.74 66.05,8.51 66.05,3.75 JP32.3
P1_30  (via drill 0.6)  (1 unrouted)
  Top 0.254: IC1.21 68.02,19.94 68.59,19.94 69.6,18.92 69.6,16.89 v69.15,16.43
  Bottom 0.254: 69.06,16.35 69.06,13.91 69.38,13.59 69.38,11.84 70.81,10.41 70.81,8.98 74.73,5.06 74.73,2.56 76.26,1.04 86.2,1.04 JP16.2 | v69.15,16.43 69.04,16.33 69.04,13.94 69.35,13.64
P1_31  (via drill 0.6)  (1 unrouted)
  Top 0.254: IC1.20 67.95,20.57 68.59,20.57 70.11,19.05 70.11,17.14 70.67,16.59 | v85.73,12.95 85.1,12.32 85.1,10.41 83.83,9.14 76.84,9.14 76.21,9.78 v75.57,9.78 | 70.18,17.08 v70.65,16.61
  Bottom 0.254: v70.65,16.61 71.76,16.61 75.57,12.79 v75.57,9.78 | 86.37,6.76 84.62,8.51 84.62,11.84 v85.73,12.95 84.64,11.86 84.64,8.51 87.64,5.51 JP17.2
P2.6  (via drill 0.6)
  Top 0.254: IC1.67 71.13,31.53 71.13,30.26 70.81,29.94 70.81,28.04 70.49,27.72 v70.49,24.38
  Bottom 0.254: v70.49,24.38 69.22,24.38 66.68,21.84 66.68,14.54 65.1,12.95 65.1,10.73 67.32,8.51 JP15.3
P2.7  (via drill 0.6)
  Top 0.254: R29.2 R28.2 29.06,37.4 29.38,37.08 29.38,30.57 v30.49,29.46 | IC1.66 71.76,31.46 v71.76,29.46
  Bottom 0.254: v71.76,29.46 69.86,27.56 67.95,27.56 55.25,14.86 55.25,6.6 54.62,5.97 37.47,5.97 36.36,7.08 36.36,14.06 29.85,20.57 29.85,28.83 v30.49,29.46
P2.9
  Top 0.254: IC1.64 76.26,34.55 R1.2
P3_25  (via drill 0.6)
  Top 0.254: IC1.27 72.24,17.27 72.24,15.49 72.08,15.33 v72.08,14.06 | v77.64,5.02 JP15.1
  Bottom 0.254: v72.08,14.06 73.03,13.11 73.03,9.78 77.64,5.17 v77.64,5.02
P3_26  (via drill 0.6)
  Top 0.254: IC1.26 71.6,17.2 71.6,15.97 70.97,15.33 70.97,12.79 v71.13,12.64 | v76.68,3.75 66.05,3.75 JP32.4
  Bottom 0.254: v71.13,12.64 72.24,11.52 72.24,9.58 76.68,5.14 v76.68,3.75
PLAY  (via drill 0.6)  (1 unrouted)
  Top 0.254: IC1.51 80.7,29.79 v81.08,29.79 | R16.1 93.72,17.66 v92.08,19.3 | PLAY.1 PLAY.2 | PLAY.2 96.18,15.84 | PLAY.2 93.75,15.84 R16.1 93.68,15.82
  Bottom 0.254: v81.08,29.79 91.57,19.3 v92.08,19.3
POT_SCL  (via drill 0.6)
  Top 0.254: 79.15,24.5 IC1.47 79.43,24.22 82.08,24.22 82.24,24.38 82.56,24.7 83.19,25.34 v84.15,25.34
  Bottom 0.254: I2C.1 84.15,25.02 v84.15,25.34
POT_SDA  (via drill 0.6)
  Top 0.254: IC1.46 79.2,23.75 82.77,23.75 v83.19,24.18
  Bottom 0.254: I2C.2 v83.19,24.18
PWM0  (via drill 0.6)
  Top 0.254: R27.2 R26.2 22.23,36.76 22.55,36.45 22.55,33.59 23.03,33.12 25.57,33.12 28.11,30.57 28.11,29.3 v31.12,26.29 | IC1.69 69.54,31.36 v69.54,30.89
  Bottom 0.254: 67.01,28.83 53.98,15.8 53.98,7.87 53.35,7.24 39.38,7.24 38.58,8.03 38.58,13.11 30.65,21.05 30.65,25.81 v31.12,26.29 | v69.54,30.89 67.48,28.83 67.01,28.83 | 67.01,28.83 67,28.83 65.41,27.24
PWM1  (via drill 0.6)
  Top 0.254: R31.2 R30.2 | IC1.68 70.49,31.6 70.49,30.42 69.7,29.62 v69.7,29.15 | v37.47,12.32 v33.66,12.32 | R30.2 22.55,20.25 | R30.2 25.73,20.25 v29.85,16.13
  Bottom 0.254: v37.47,12.32 37.47,7.24 38.11,6.6 53.98,6.6 54.62,7.24 54.62,15.33 67.48,28.19 68.75,28.19 v69.7,29.15 | v29.85,16.13 v33.66,12.32
RX_0
  Top 0.254: IC1.99 59.89,29.62 55.41,29.62 54.62,28.83 54.62,18.19 55.73,17.08 55.73,8.67 57.16,7.24 91.45,7.24 92.72,5.97 92.72,3.43 91.76,2.48 JP16.1
SCK1  (via drill 0.6)
  Top 0.254: IC1.62 73.99,30.85 73.99,30.26 72.87,29.15 v72.87,28.19
  Bottom 0.254: v72.87,28.19 73.19,27.88 75.26,27.88 80.65,22.48 80.65,7.24 81.29,6.6 81.29,3.75 JP16.4
SCL  (via drill 0.6)  (1 unrouted)
  Top 0.254: IC1.24 67.32,17.11 67.32,14.22 70.02,11.52 v73.99,11.52
  Bottom 0.254: v73.99,11.52 74.62,10.89 74.62,9.14 75.26,8.51 | JP17.5 80.02,7.87 79.38,8.51 75.24,8.51 74.63,9.12
SD_CS  (via drill 0.6)
  Top 0.254: IC1.79 63.83,39.83 v63.83,40.42 | U1.2 47.84,13.39 49.84,11.38 49.84,8.81 48.9,7.87 43.19,7.87 42.55,8.51 42.55,10.21 v42.88,10.54
  Bottom 0.254: v63.83,40.42 63.83,39.94 63.51,39.62 53.98,39.62 52.71,38.35 52.71,20.26 49.85,17.4 46.34,17.4 42.88,13.94 v42.88,10.54
SD_MISO  (via drill 0.6)
  Top 0.254: 67.32,37.75 IC1.77 67.16,37.91 v67.16,39.94 | U1.7 42.34,13.17 43.19,12.32 44.46,12.32 45.09,11.68 v45.09,9.78
  Bottom 0.254: v45.09,9.78 45.09,13.59 47.63,16.13 50.49,16.13 53.98,19.62 53.98,37.72 54.78,38.51 64.3,38.51 65.73,39.94 v67.16,39.94
SD_MOSI  (via drill 0.6)
  Top 0.254: v43.82,9.14 44.46,8.51 48.27,8.51 49.23,9.47 49.23,11.15 48.06,12.32 47,12.32 46.74,12.58 U1.3 | IC1.76 67.95,37.82 67.95,38.67 68.59,39.31 v68.59,40.1
  Bottom 0.254: v43.82,9.14 43.82,13.59 47,16.76 50.17,16.76 53.35,19.94 53.35,38.04 54.3,38.99 63.83,38.99 65.73,40.89 67.95,40.89 68.59,40.26 v68.59,40.1
SD_SCK  (via drill 0.6)  (1 unrouted)
  Top 0.254: IC1.78 66.05,38.31 | 67.57,36.8 66.05,38.33 v66.05,38.99 | U1.5 44.54,12.88 45.73,11.68 45.73,11.05 v47,9.78
  Bottom 0.254: 64.99,37.88 55.09,37.88 54.62,37.4 54.62,19.3 50.81,15.49 48.27,15.49 47,14.22 v47,9.78 | 64.99,37.88 66.05,38.94 | 64.99,37.88 64.99,37.93 v66.05,38.99
SDA  (via drill 0.6)
  Top 0.254: IC1.25 67.95,17.04 67.95,15.49 68.59,14.86 v70.02,14.86
  Bottom 0.254: v70.02,14.86 70.02,12.16 71.45,10.73 71.45,9.46 75.57,5.33 75.57,3.05 76.14,2.48 JP16.5
SSEL1  (via drill 0.6)
  Top 0.254: 73.67,31.24 IC1.63 73.32,30.89 v73.03,30.89
  Bottom 0.254: v73.03,30.89 73.03,29.46 73.99,28.51 75.57,28.51 81.29,22.8 81.29,7.87 82.56,6.6 JP17.4
STP1  (via drill 0.6)
  Top 0.254: IC1.75 71.76,37.82 71.76,38.35 68.75,41.37 56.52,41.37 53.82,44.07 41.12,44.07 39.22,45.97 39.22,48.99 v39.38,49.15
  Bottom 0.254: 38.74,49.78 v39.38,49.15 37.96,50.57 34.35,50.57 33.73,49.96 20.34,49.96 U$11.STEP
STP2
  Top 0.254: IC1.74 72.24,37.59 72.24,38.51 68.9,41.85 57,41.85 54.14,44.7 42.55,44.7 41.76,45.5 41.76,49.62 40.97,50.42 38.74,50.42 37.95,49.62 U$12.STEP
STP3  (1 unrouted)
  Top 0.254: IC1.73 72.87,37.52 72.87,38.51 69.06,42.32 61.9,42.32 58.38,45.85 | U$13.STEP 58.27,45.97 58.74,45.5
STP4  (via drill 0.6)  (1 unrouted)
  Top 0.254: IC1.70 73.92,36.45 | v78.11,45.02 78.11,40.58 72.87,35.34
  Bottom 0.254: v78.11,45.02 78.11,46.77 U$14.STEP
STP5  (via drill 0.6)
  Top 0.254: v79.38,44.07 79.38,40.26 76.21,37.08 76.21,35.2 IC1.65
  Bottom 0.254: v79.38,44.07 83.19,44.07 84.94,45.82 84.94,47.88 85.57,48.51 98.43,48.51 98.91,48.04 U$15.STEP
TH1  (via drill 0.6)  (1 unrouted)
  Top 0.254: 64.62,25.02 IC1.9 66.84,27.24 v66.84,31.84 | 95.55,31.96 v97.37,31.96 100.7,31.96 101.29,31.37 JP12.3 | R24.1 95.1,31.84 95.26,32
  Top 0.406: 95.26,32.32 95.26,32 C19.2
  Bottom 0.254: v66.84,31.84 66.84,32.64 67.48,33.27 68.59,33.27 73.03,37.72 76.21,37.72 85.73,28.19 90.49,28.19 94.26,31.96 v97.37,31.96
TH2  (via drill 0.6)  (1 unrouted)
  Top 0.254: 64.42,25.53 IC1.8 65.73,26.84 v65.73,30.89 65.73,26.92 | v93.19,26.13 R23.1 93.24,27.92 C18.2 96.73,27.92 97.32,28.51 100.02,28.51 JP12.2
  Bottom 0.254: v65.73,30.89 67.32,30.89 67.79,31.37 67.79,31.84 73.19,37.24 75.89,37.24 87,26.13 v93.19,26.13
TH3  (via drill 0.6)  (1 unrouted)
  Top 0.254: IC1.7 62.26,24.09 64.78,26.61 v64.78,28.19 | 95.26,21.84 95.1,22 R22.1 93.19,24.39 v93.04,24.54
  Bottom 0.254: v64.78,28.19 66.68,30.1 67.48,30.1 68.43,31.05 68.43,31.69 73.51,36.77 75.57,36.77 87.8,24.54 v93.04,24.54 95.57,24.54 97.8,22.32 100.5,22.32 101.29,23.11 JP12.1
TX_0
  Top 0.254: IC1.98 60.12,30.1 54.94,30.1 53.98,29.15 53.98,17.72 55.02,16.68 55.02,8.36 56.78,6.6 88.59,6.6 JP17.1
USB_D+  (via drill 0.6)
  Top 0.254: IC1.29 72.16,18.78 | IC1.29 67.95,22.97 | 69.38,21.53 66.68,24.22 v66.68,24.38 66.68,24.24 IC1.29 | v15.72,57.4 R8.2 | v33.5,56.13 33.5,54.39 31.6,52.48 31.6,44.55 v31.12,44.07
  Top 0.305: R7.1 R8.2 C5.2
  Bottom 0.254: v66.68,24.38 55.89,13.59 55.89,5.97 55.25,5.33 36.84,5.33 35.57,6.6 35.57,13.59 29.22,19.94 29.22,42.16 v31.12,44.07 | v15.72,57.4 33.03,57.4 33.5,56.93 v33.5,56.13
USB_D-  (via drill 0.6)  (1 unrouted)
  Top 0.254: IC1.30 67.95,23.68 v67.95,25.65 | v31.92,56.13 31.92,54.23 29.06,51.37 29.06,44.23 v28.74,43.91 | C4.2 10.33,57.09 10.64,57.4 v13.98,57.4 | R9.2 10.32,55.5 10.33,55.5
  Bottom 0.254: v67.95,25.65 67.95,24.38 56.52,12.95 56.52,5.33 55.89,4.7 36.2,4.7 34.77,6.13 34.77,13.11 28.42,19.46 28.42,43.59 v28.74,43.91 | v31.92,56.13 14.61,56.13 13.98,56.77 v13.98,57.4
VBB  (via drill 0.6)  (3 unrouted)
  Top 0.61: C14.+ 42.39,59.31 U$13.VMOT | C1.+ 83.03,59.31 U$15.VMOT
  Top 0.813: 27.79,25.97 29.22,24.54 | 27.79,25.97 27.79,25.81 29.85,23.75 | 32.39,6.6 v32.39,11.05 | 32.39,11.68 32.39,13.59 | 32.39,13.59 32.39,16.13 | 32.39,16.76 32.39,19.94 31.76,20.57 | 26.94,26.03 29.22,23.75 | 29.22,23.75 31.12,21.84 | 31.12,21.84 31.76,21.84 | 31.76,21.84 32.39,21.21 33.03,21.21 | 36.2,21.21 39.38,21.21 40.01,21.84 31.76,21.84 | 33.66,20.57 32.39,20.57 31.76,21.21 31.12,21.84 | 33.66,20.57 35.57,20.57 36.2,21.21 | 36.2,21.21 34.93,21.21 | 34.93,21.21 33.03,21.21 | 33.03,21.21 33.03,14.22 | 33.03,14.22 32.39,13.59 | 33.03,14.22 34.93,16.13 34.93,16.76 | 34.93,21.21 34.93,18.67 | 34.93,18.67 34.93,17.4 | 34.93,17.4 34.93,16.76 | 34.93,16.76 33.66,15.49 33.66,16.13 34.93,17.4 | 34.93,17.4 34.3,17.4 33.66,16.76 33.66,17.4 34.93,18.67 | 34.93,18.67 34.3,18.67 33.66,18.03 33.66,19.3 | 33.66,20.57 33.66,19.3 | 33.66,19.3 31.76,17.4 | 31.76,9.78 33.66,9.78 v32.39,11.05 | v32.39,11.05 32.39,11.68 | 32.39,11.68 34.3,9.78 34.3,8.51 | v19.06,28.83 21.86,26.03 25.62,26.03 26.94,26.03 | 26.94,26.03 27.73,26.03 27.79,25.97 | 29.22,22.48 29.22,21.21 | 29.22,21.21 29.22,19.94 | 29.22,19.94 29.22,19.3 32.39,16.13 | 32.39,16.13 32.39,16.76 | 32.39,16.76 29.22,19.94 | 29.22,19.94 29.85,19.94 31.12,18.67 31.12,19.94 | 31.12,19.94 31.12,20.57 29.85,20.57 29.22,21.21 | 29.22,21.21 29.85,21.21 31.12,19.94 | 31.12,19.94 30.49,19.94 30.49,21.21 | 30.49,21.21 29.22,22.48 | 29.22,23.75 29.22,22.48 | 29.22,22.48 29.85,22.48 29.85,21.84 30.49,21.84 30.49,21.21 | 30.49,21.21 31.12,21.21
  Top 1.016: F2.2 31.76,5.97 31.76,9.14 | 31.76,9.14 31.76,9.78 31.76,17.4 31.76,20.57 31.76,21.21 31.76,21.84 | 31.76,21.84 31.76,22 27.79,25.97 | R32.1 R33.1 | 25.62,26.03 25.73,26.13 | 34.46,19.78 34.3,19.62 34.3,21.53 33.98,21.84 | 33.98,21.84 31.76,21.84 | C15.+ U$12.VMOT | 33.98,21.84 40.01,21.84 IC3.1 | D7.C 31.76,9.14
  Top 1.27: v32.39,11.05 v31.12,12.32 v29.85,13.59 v27.95,13.59
  Top 1.778: U$12.VMOT 22.71,55.1 22.72,55.09 | U$13.VMOT 43.03,59.05 42.39,58.41 C14.+ | C8.+ 62.71,57.9 63.25,58.45 | U$14.VMOT 63.35,58.52 62.87,58.04 | U$15.VMOT 83.67,59.15 83.19,58.67 83.19,54.97 83.17,54.94
  Top 2.54: F2.2 34.93,4.7 34.93,5.97 33.03,7.87 33.03,5.33 31.12,5.33 | 31.12,5.33 30.49,4.7 | 31.12,5.33 31.76,5.97 32.39,6.6 | v20.33,28.83 v19.06,28.83 v17.79,28.83 v16.52,28.83
  Bottom 0.254: v16.52,28.83 13.34,28.83 | 2.55,61.21 63.35,61.21 82.56,61.21 | U$11.VMOT 1.28,59.94 0.64,59.31 | 0.64,32.64 1.28,32 6.99,32 | 6.99,33.27 6.99,41.85 3.66,45.18 3.66,50.58 3.18,51.05 3.18,56.19 3.66,56.66 | 2.71,59.94 U$11.VMOT | U$11.VMOT 3.66,58.67 3.66,57.33 | 3.66,56.66 3.67,56.67 | 3.66,57.33 3.67,57.33 | 3.66,57.33 3.66,56.66
  Bottom 1.016: v19.06,28.83 v17.79,28.83 v16.52,28.83 12.07,28.83 10.8,27.56 U$3.P$4 8.26,26.92 6.99,28.19 6.99,32 6.99,33.27 6.99,35.81 8.26,37.08 U$3.P$2 5.72,37.08 5.09,37.72 5.09,44.07 6.36,45.34 20.33,45.34 | 22.71,61.53 2.86,61.53 2.39,61.05 U$11.VMOT | 22.71,61.53 43.03,61.53 | 43.03,61.53 83.03,61.53 83.67,60.9 U$15.VMOT | U$12.VMOT 22.71,61.53 | U$13.VMOT 43.03,61.53 | U$14.VMOT 63.35,61.21
  pour Bottom: 0.64,65.66 0.64,25.5 1.28,24.86 12.87,24.86 13.4,26.74 19.06,26.77 21.72,26.7 21.92,25.02 21.92,12.32 29.85,12.32 31.12,10.41 30.49,7.87 28.58,5.33 28.58,2.79 36.84,2.79 36.84,14.22 31.12,19.94 29.22,23.11 27.95,27.56 27.95,45.02 28.58,46.29 28.9,47.56 28.9,48.99 63.03,48.83 100.5,48.83 104.81,48.88 104.78,66.93 104.31,67.41 1.6,66.77 1.44,66.61
VBB2  (via drill 0.6)  (1 unrouted)
  Top 0.254: R34.1 16.52,15.49
  Top 1.016: U$3.P$6 13.98,16.76 13.98,14.22 F1.2
  Top 2.54: U$3.P$6 8.9,16.76 9.53,16.13 10.17,16.13 15.88,10.41 F1.2 | U$3.P$6 13.34,16.76 | 13.34,16.76 13.98,16.76 17.15,13.59 | 17.15,13.59 17.15,11.05 F1.2 | F1.2 19.69,10.41 | U$3.P$6 12.07,16.76 15.88,12.95 17.79,12.95 | 17.79,12.95 20.33,10.41 19.69,10.41 | 19.69,10.41 13.34,16.76 | 17.15,13.59 17.79,12.95 | U$3.P$6 11.44,16.76 13.34,14.86
  Bottom 0.813: F1.2 17.79,14.22 | 17.79,14.22 14.61,17.4 8.26,17.4 8.26,16.13 8.9,16.13 15.25,9.78 20.33,9.78 20.96,10.41 20.96,11.05 17.79,14.22
  Bottom 2.54: 20.33,10.41 F1.2 15.88,10.41 15.88,11.05 10.17,16.76 13.98,16.76 13.98,16.13 18.42,11.68 14.61,11.68 9.53,16.76 8.9,16.76 9.53,16.13 11.44,16.13 12.07,15.49
  other vias: 17.79,10.41
VUSB  (via drill 0.6)  (1 unrouted)
  Top 0.254: v35.25,43.12 34.62,43.12 34.14,43.59 34.14,52.48 v33.66,52.96 | 5.18,54.96 5.4,55.18 5.4,56.77 5.88,57.25 8.74,57.25 v8.9,57.4 | X1.VBUS 5.14,54.95 5.39,55.19 5.39,56.77 5.49,56.87
  Bottom 0.254: v35.25,43.12 38.11,40.26 +5V.3 | v33.66,52.96 10.17,52.96 8.9,54.23 v8.9,57.4
X_STOP  (via drill 0.6)  (1 unrouted)
  Top 0.254: v89.54,29.78 89.54,23.27 84.62,18.35 78.94,18.35 IC1.38 | C78.1 v89.82,44.07 91.45,44.07
  Bottom 0.254: v89.82,44.07 91.45,44.07 92.08,43.43 92.08,31.69 90.18,29.78 v89.54,29.78
Y_STOP  (via drill 0.6)  (1 unrouted)
  Top 0.254: R95.2 v89.82,41.53 C79.1 | v89.54,31.37 88.91,31.37 88.27,30.73 88.27,22.8 84.3,18.83 79.86,18.83 76.05,22.64
  Bottom 0.254: v89.54,31.37 90.81,31.37 91.29,31.84 91.29,40.89 90.65,41.53 v89.82,41.53
Z_STOP  (via drill 0.6)
  Top 0.254: R97.2 v89.82,38.99 C80.1 | IC1.44 78.74,22.8 85.41,22.8 87.64,25.02 87.64,32.32 88.27,32.96 v89.86,32.96
  Bottom 0.254: v89.82,38.99 89.82,33 v89.86,32.96

## Text on the board
bPlace: Micro USB | AZSMZ Mini Ver2.0 By 2015.03.05 | End Stops | Temperature
tNames: ENDSTOPS | - | + | s
tDocu: MS1 | MS2
_tsilk: D10 | + | D9 | T0 | + | T1 | T2 | D8 | + | + | GND | - | - | micro SD